# EAGLE design i2c-4x8matrix-relays (EAGLE 7.5.0)
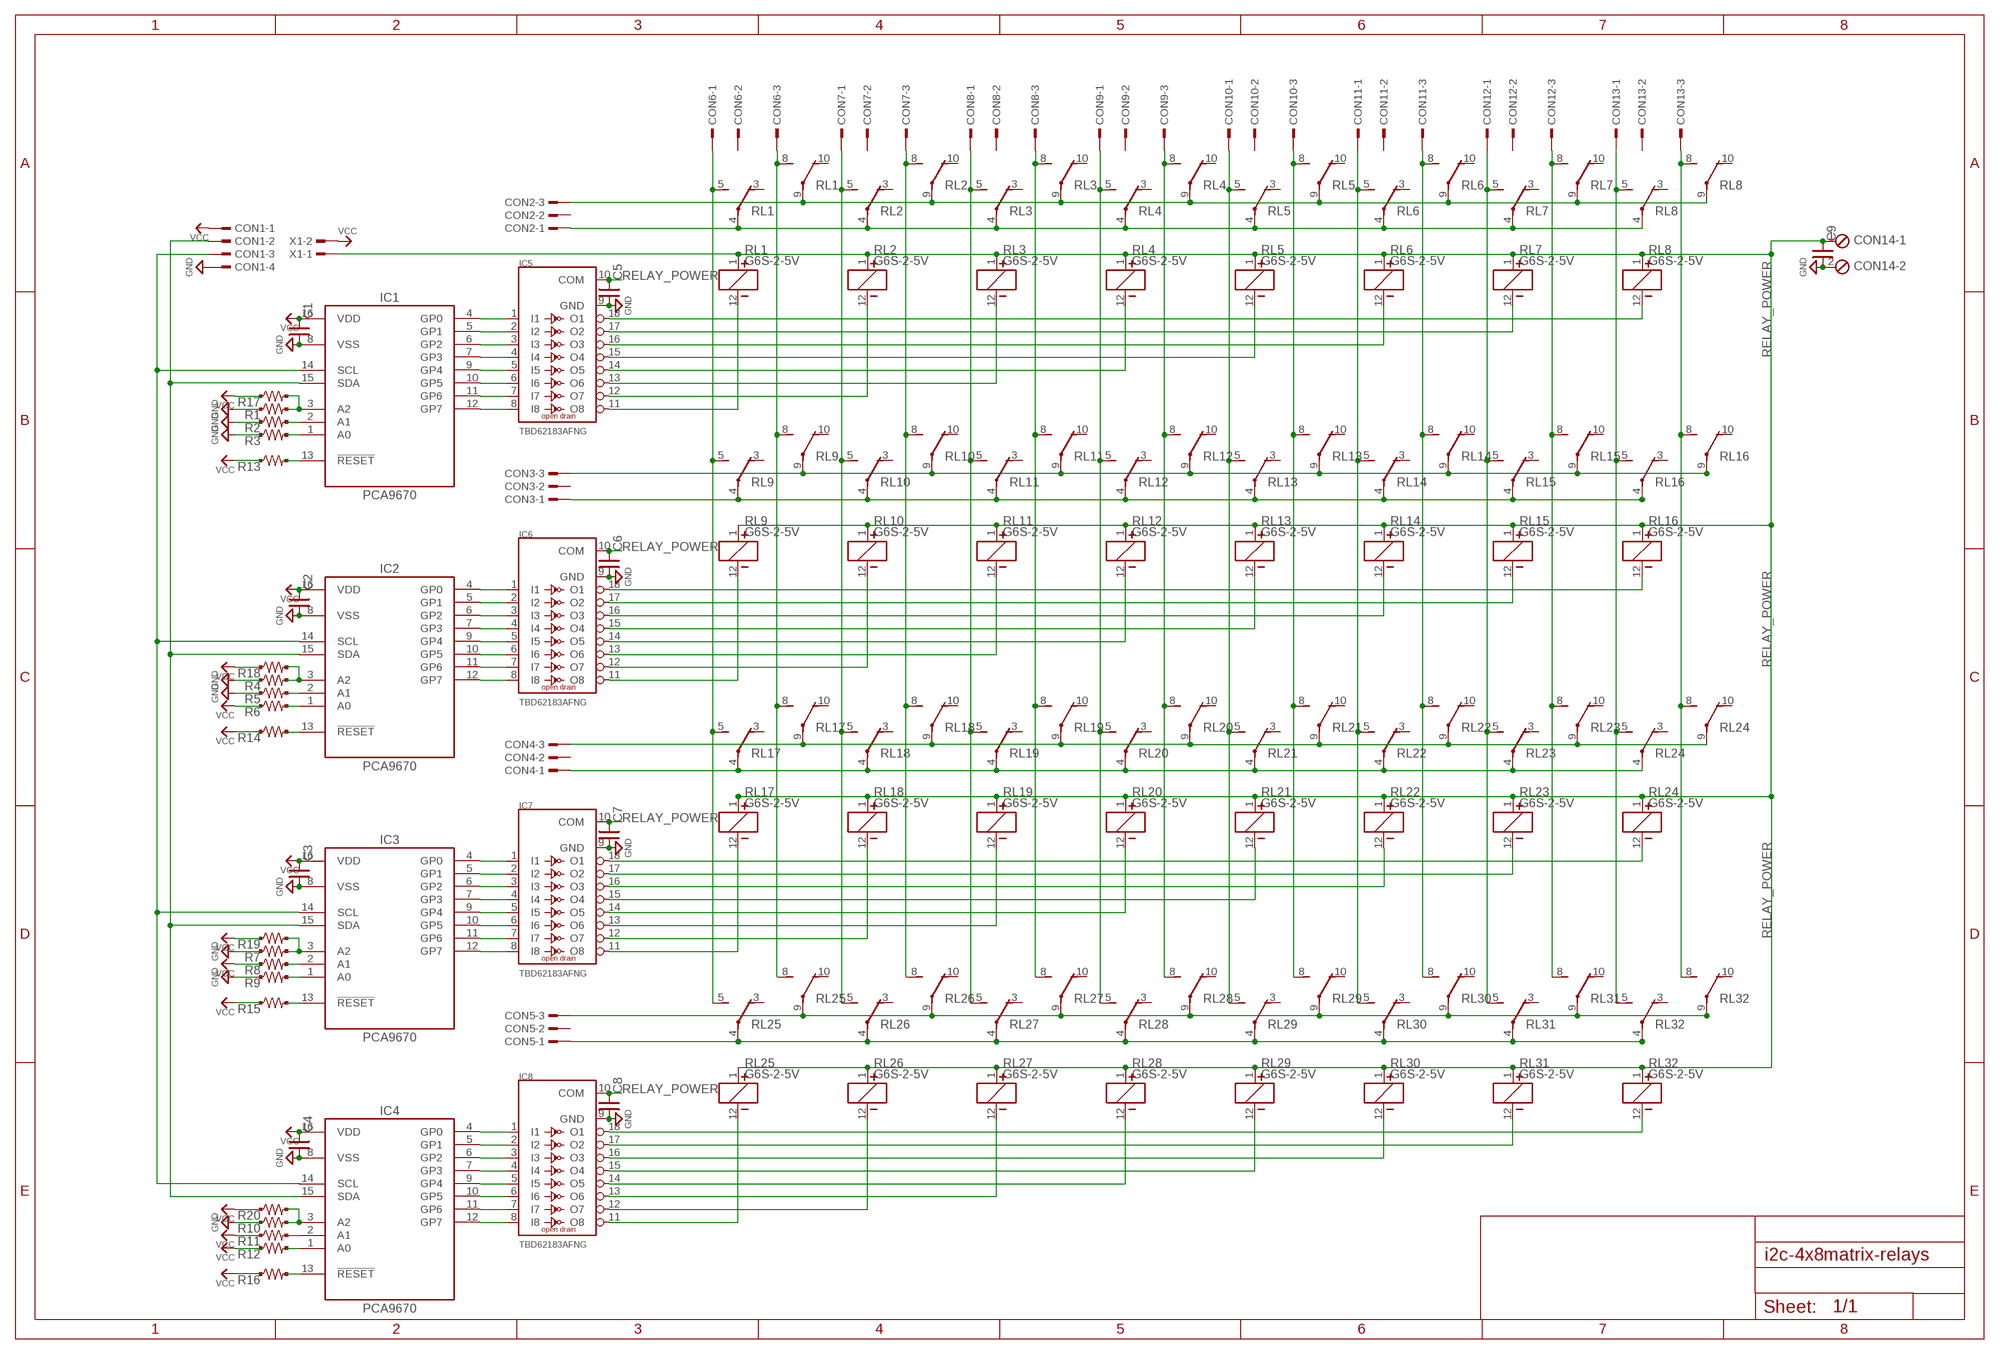
[diagram p0: schematic, sheet 1]

## Parts
C1  C-SMD-0.1U-1005  [C0402]
C2  C-SMD-0.1U-1005  [C0402]
C3  C-SMD-0.1U-1005  [C0402]
C4  C-SMD-0.1U-1005  [C0402]
C5  C-SMD-0.1U-1005  [C0402]
C6  C-SMD-0.1U-1005  [C0402]
C7  C-SMD-0.1U-1005  [C0402]
C8  C-SMD-0.1U-1005  [C0402]
C9  C-SMD-10U-1608  [CR-1608]
CON1  S4B-XH-A  [S4B-XH-A(LF)(SN)]
CON2  S3B-XH-A  [S3B-XH-A(LF)(SN)]
CON3  S3B-XH-A  [S3B-XH-A(LF)(SN)]
CON4  S3B-XH-A  [S3B-XH-A(LF)(SN)]
CON5  S3B-XH-A  [S3B-XH-A(LF)(SN)]
CON6  S3B-XH-A  [S3B-XH-A(LF)(SN)]
CON7  S3B-XH-A  [S3B-XH-A(LF)(SN)]
CON8  S3B-XH-A  [S3B-XH-A(LF)(SN)]
CON9  S3B-XH-A  [S3B-XH-A(LF)(SN)]
CON10  S3B-XH-A  [S3B-XH-A(LF)(SN)]
CON11  S3B-XH-A  [S3B-XH-A(LF)(SN)]
CON12  S3B-XH-A  [S3B-XH-A(LF)(SN)]
CON13  S3B-XH-A  [S3B-XH-A(LF)(SN)]
CON14  ETB43024B  [ETB43024]
IC1  PCA9670  [SOT65P510X450X110-16N]
IC2  PCA9670  [SOT65P510X450X110-16N]
IC3  PCA9670  [SOT65P510X450X110-16N]
IC4  PCA9670  [SOT65P510X450X110-16N]
IC5  TBD62183AFNG  [SOT65P640X440-18N]
IC6  TBD62183AFNG  [SOT65P640X440-18N]
IC7  TBD62183AFNG  [SOT65P640X440-18N]
IC8  TBD62183AFNG  [SOT65P640X440-18N]
R1  R-US--1005SHORT  [R0402SHORT]
R2  R-US--1005SHORT  [R0402SHORT]
R3  R-US--1005SHORT  [R0402SHORT]
R4  R-US--1005SHORT  [R0402SHORT]
R5  R-US--1005SHORT  [R0402SHORT]
R6  R-US--1005SHORT  [R0402SHORT]
R7  R-US--1005SHORT  [R0402SHORT]
R8  R-US--1005SHORT  [R0402SHORT]
R9  R-US--1005SHORT  [R0402SHORT]
R10  R-US--1005SHORT  [R0402SHORT]
R11  R-US--1005SHORT  [R0402SHORT]
R12  R-US--1005SHORT  [R0402SHORT]
R13  R-US--1005SHORT  [R0402SHORT]
R14  R-US--1005SHORT  [R0402SHORT]
R15  R-US--1005SHORT  [R0402SHORT]
R16  R-US--1005SHORT  [R0402SHORT]
R17  R-US-10K-1005  [C0402]
R18  R-US-10K-1005  [C0402]
R19  R-US-10K-1005  [C0402]
R20  R-US-10K-1005  [C0402]
RL1  G6S-2-5V  [G6S-2]
RL2  G6S-2-5V  [G6S-2]
RL3  G6S-2-5V  [G6S-2]
RL4  G6S-2-5V  [G6S-2]
RL5  G6S-2-5V  [G6S-2]
RL6  G6S-2-5V  [G6S-2]
RL7  G6S-2-5V  [G6S-2]
RL8  G6S-2-5V  [G6S-2]
RL9  G6S-2-5V  [G6S-2]
RL10  G6S-2-5V  [G6S-2]
RL11  G6S-2-5V  [G6S-2]
RL12  G6S-2-5V  [G6S-2]
RL13  G6S-2-5V  [G6S-2]
RL14  G6S-2-5V  [G6S-2]
RL15  G6S-2-5V  [G6S-2]
RL16  G6S-2-5V  [G6S-2]
RL17  G6S-2-5V  [G6S-2]
RL18  G6S-2-5V  [G6S-2]
RL19  G6S-2-5V  [G6S-2]
RL20  G6S-2-5V  [G6S-2]
RL21  G6S-2-5V  [G6S-2]
RL22  G6S-2-5V  [G6S-2]
RL23  G6S-2-5V  [G6S-2]
RL24  G6S-2-5V  [G6S-2]
RL25  G6S-2-5V  [G6S-2]
RL26  G6S-2-5V  [G6S-2]
RL27  G6S-2-5V  [G6S-2]
RL28  G6S-2-5V  [G6S-2]
RL29  G6S-2-5V  [G6S-2]
RL30  G6S-2-5V  [G6S-2]
RL31  G6S-2-5V  [G6S-2]
RL32  G6S-2-5V  [G6S-2]
X1  PH-1X2SG  [PH-1X2SG]

## Nets
GND: C1.2 C2.2 C3.2 C4.2 C5.2 C6.2 C7.2 C8.2 C9.2 CON1.4 CON14.2 IC1.8(VSS) IC2.8(VSS) IC3.8(VSS) IC4.8(VSS) IC5.9(GND) IC6.9(GND) IC7.9(GND) IC8.9(GND) R1.1 R1.2 R2.1 R2.2 R3.1 R3.2 R4.1 R4.2 R5.1 R5.2 R7.1 R7.2 R9.1 R9.2 R10.1 R10.2
N$1: CON3.1 RL9.4(COM) RL10.4(COM) RL11.4(COM) RL12.4(COM) RL13.4(COM) RL14.4(COM) RL15.4(COM) RL16.4(COM)
N$2: CON4.1 RL17.4(COM) RL18.4(COM) RL19.4(COM) RL20.4(COM) RL21.4(COM) RL22.4(COM) RL23.4(COM) RL24.4(COM)
N$3: CON2.1 RL1.4(COM) RL2.4(COM) RL3.4(COM) RL4.4(COM) RL5.4(COM) RL6.4(COM) RL7.4(COM) RL8.4(COM)
N$4: CON2.3 RL1.9(COM) RL2.9(COM) RL3.9(COM) RL4.9(COM) RL5.9(COM) RL6.9(COM) RL7.9(COM) RL8.9(COM)
N$6: CON6.1 RL1.5(NO) RL9.5(NO) RL17.5(NO) RL25.5(NO)
N$8: CON7.1 RL2.5(NO) RL10.5(NO) RL18.5(NO) RL26.5(NO)
N$9: CON3.3 RL9.9(COM) RL10.9(COM) RL11.9(COM) RL12.9(COM) RL13.9(COM) RL14.9(COM) RL15.9(COM) RL16.9(COM)
N$10: CON4.3 RL17.9(COM) RL18.9(COM) RL19.9(COM) RL20.9(COM) RL21.9(COM) RL22.9(COM) RL23.9(COM) RL24.9(COM)
N$11: IC8.18(O1) RL32.12
N$12: IC8.11(O8) RL25.12
N$13: CON8.1 RL3.5(NO) RL11.5(NO) RL19.5(NO) RL27.5(NO)
N$14: CON9.1 RL4.5(NO) RL12.5(NO) RL20.5(NO) RL28.5(NO)
N$15: IC1.4(GP0) IC5.1(I1)
N$16: IC1.5(GP1) IC5.2(I2)
N$26: IC1.6(GP2) IC5.3(I3)
N$36: CON6.3 RL1.8(NO) RL9.8(NO) RL17.8(NO) RL25.8(NO)
N$37: IC1.7(GP3) IC5.4(I4)
N$38: IC1.9(GP4) IC5.5(I5)
N$39: IC7.11(O8) RL17.12
N$40: CON7.3 RL2.8(NO) RL10.8(NO) RL18.8(NO) RL26.8(NO)
N$41: CON9.3 RL4.8(NO) RL12.8(NO) RL20.8(NO) RL28.8(NO)
N$42: CON8.3 RL3.8(NO) RL11.8(NO) RL19.8(NO) RL27.8(NO)
N$43: CON5.1 RL25.4(COM) RL26.4(COM) RL27.4(COM) RL28.4(COM) RL29.4(COM) RL30.4(COM) RL31.4(COM) RL32.4(COM)
N$44: CON5.3 RL25.9(COM) RL26.9(COM) RL27.9(COM) RL28.9(COM) RL29.9(COM) RL30.9(COM) RL31.9(COM) RL32.9(COM)
N$45: CON10.1 RL5.5(NO) RL13.5(NO) RL21.5(NO) RL29.5(NO)
N$46: CON10.3 RL5.8(NO) RL13.8(NO) RL21.8(NO) RL29.8(NO)
N$47: CON11.1 RL6.5(NO) RL14.5(NO) RL22.5(NO) RL30.5(NO)
N$48: CON11.3 RL6.8(NO) RL14.8(NO) RL22.8(NO) RL30.8(NO)
N$49: CON12.1 RL7.5(NO) RL15.5(NO) RL23.5(NO) RL31.5(NO)
N$50: CON12.3 RL7.8(NO) RL15.8(NO) RL23.8(NO) RL31.8(NO)
N$51: CON13.1 RL8.5(NO) RL16.5(NO) RL24.5(NO) RL32.5(NO)
N$52: CON13.3 RL8.8(NO) RL16.8(NO) RL24.8(NO) RL32.8(NO)
N$53: IC1.10(GP5) IC5.6(I6)
N$54: IC7.15(O4) RL21.12
N$55: IC7.18(O1) RL24.12
N$56: IC7.14(O5) RL20.12
N$57: IC7.12(O7) RL18.12
N$58: IC7.13(O6) RL19.12
N$59: IC7.16(O3) RL22.12
N$60: IC7.17(O2) RL23.12
N$61: IC1.11(GP6) IC5.7(I7)
N$62: IC1.12(GP7) IC5.8(I8)
N$63: IC2.4(GP0) IC6.1(I1)
N$64: IC2.5(GP1) IC6.2(I2)
N$65: IC2.6(GP2) IC6.3(I3)
N$66: IC2.7(GP3) IC6.4(I4)
N$67: IC2.9(GP4) IC6.5(I5)
N$68: IC2.10(GP5) IC6.6(I6)
N$69: IC2.11(GP6) IC6.7(I7)
N$70: IC2.12(GP7) IC6.8(I8)
N$71: IC3.4(GP0) IC7.1(I1)
N$72: IC3.5(GP1) IC7.2(I2)
N$73: IC3.6(GP2) IC7.3(I3)
N$74: IC3.7(GP3) IC7.4(I4)
N$75: IC3.9(GP4) IC7.5(I5)
N$76: IC3.10(GP5) IC7.6(I6)
N$77: IC3.11(GP6) IC7.7(I7)
N$78: IC3.12(GP7) IC7.8(I8)
N$79: IC4.4(GP0) IC8.1(I1)
N$80: IC4.5(GP1) IC8.2(I2)
N$81: IC4.6(GP2) IC8.3(I3)
N$82: IC4.7(GP3) IC8.4(I4)
N$83: IC4.9(GP4) IC8.5(I5)
N$84: IC4.10(GP5) IC8.6(I6)
N$85: IC4.11(GP6) IC8.7(I7)
N$86: IC4.12(GP7) IC8.8(I8)
N$87: IC8.17(O2) RL31.12
N$88: IC8.12(O7) RL26.12
N$89: CON1.3 IC1.14(SCL) IC2.14(SCL) IC3.14(SCL) IC4.14(SCL)
N$90: CON1.2 IC1.15(SDA) IC2.15(SDA) IC3.15(SDA) IC4.15(SDA)
N$91: IC8.13(O6) RL27.12
N$92: IC8.14(O5) RL28.12
N$93: IC8.15(O4) RL29.12
N$94: IC8.16(O3) RL30.12
N$95: IC4.1(A0) R12.3
N$96: IC4.2(A1) R11.3
N$97: IC4.3(A2) R10.3 R20.2
N$98: IC3.1(A0) R9.3
N$99: IC3.2(A1) R8.3
N$100: IC3.3(A2) R7.3 R19.2
N$101: IC2.1(A0) R6.3
N$102: IC2.2(A1) R5.3
N$103: IC2.3(A2) R4.3 R18.2
N$104: IC1.1(A0) R3.3
N$105: IC1.2(A1) R2.3
N$106: IC1.3(A2) R1.3 R17.2
N$107: IC1.13(!RESET!) R13.3
N$108: IC2.13(!RESET!) R14.3
N$109: IC3.13(!RESET!) R15.3
N$110: IC4.13(!RESET!) R16.3
N$112: IC6.11(O8) RL9.12
N$113: IC6.12(O7) RL10.12
N$114: IC6.13(O6) RL11.12
N$115: IC6.14(O5) RL12.12
N$116: IC6.15(O4) RL13.12
N$117: IC6.16(O3) RL14.12
N$118: IC6.17(O2) RL15.12
N$119: IC6.18(O1) RL16.12
N$120: IC5.11(O8) RL1.12
N$121: IC5.12(O7) RL2.12
N$122: IC5.13(O6) RL3.12
N$123: IC5.14(O5) RL4.12
N$124: IC5.15(O4) RL5.12
N$125: IC5.16(O3) RL6.12
N$126: IC5.17(O2) RL7.12
N$127: IC5.18(O1) RL8.12
RELAY_POWER: C5.1 C6.1 C7.1 C8.1 C9.1 CON14.1 IC5.10(COM) IC6.10(COM) IC7.10(COM) IC8.10(COM) RL1.1 RL2.1 RL3.1 RL4.1 RL5.1 RL6.1 RL7.1 RL8.1 RL9.1 RL10.1 RL11.1 RL12.1 RL13.1 RL14.1 RL15.1 RL16.1 RL17.1 RL18.1 RL19.1 RL20.1 RL21.1 RL22.1 RL23.1 RL24.1 RL25.1 RL26.1 RL27.1 RL28.1 RL29.1 RL30.1 RL31.1 RL32.1 X1.1
VCC: C1.1 C2.1 C3.1 C4.1 CON1.1 IC1.16(VDD) IC2.16(VDD) IC3.16(VDD) IC4.16(VDD) R6.1 R6.2 R8.1 R8.2 R11.1 R11.2 R12.1 R12.2 R13.1 R13.2 R14.1 R14.2 R15.1 R15.2 R16.1 R16.2 R17.1 R18.1 R19.1 R20.1 X1.2
Unconnected: CON2.2 CON3.2 CON4.2 CON5.2 CON6.2 CON7.2 CON8.2 CON9.2 CON10.2 CON11.2 CON12.2 CON13.2 RL1.3(NC) RL1.10(NC) RL2.3(NC) RL2.10(NC) RL3.3(NC) RL3.10(NC) RL4.3(NC) RL4.10(NC) RL5.3(NC) RL5.10(NC) RL6.3(NC) RL6.10(NC) RL7.3(NC) RL7.10(NC) RL8.3(NC) RL8.10(NC) RL9.3(NC) RL9.10(NC) RL10.3(NC) RL10.10(NC) RL11.3(NC) RL11.10(NC) RL12.3(NC) RL12.10(NC) RL13.3(NC) RL13.10(NC) RL14.3(NC) RL14.10(NC) RL15.3(NC) RL15.10(NC) RL16.3(NC) RL16.10(NC) RL17.3(NC) RL17.10(NC) RL18.3(NC) RL18.10(NC) RL19.3(NC) RL19.10(NC) RL20.3(NC) RL20.10(NC) RL21.3(NC) RL21.10(NC) RL22.3(NC) RL22.10(NC) RL23.3(NC) RL23.10(NC) RL24.3(NC) RL24.10(NC) RL25.3(NC) RL25.10(NC) RL26.3(NC) RL26.10(NC) RL27.3(NC) RL27.10(NC) RL28.3(NC) RL28.10(NC) RL29.3(NC) RL29.10(NC) RL30.3(NC) RL30.10(NC) RL31.3(NC) RL31.10(NC) RL32.3(NC) RL32.10(NC)

## Library data of the parts
C1-C8 = mylib:C-SMD-*: SMD CAPACITOR; DIGIKEY: 490-3261-1-ND; SEEED: 302010024; SMD-PAD: 2
C9 = mylib:C-SMD-*: SMD CAPACITOR; DIGIKEY: 445-11238-1-ND; SMD-PAD: 2
CON1 = mylib:S4B-XH-A; DIGIKEY: 455-2243-ND
CON2-CON13 = mylib:S3B-XH-A; DIGIKEY: 455-2250-ND
CON14 = mylib:ETB43024*; AKIZUKI: P-11589; DIGIKEY: 277-6765-ND
IC1-IC4 = mylib:PCA9670
IC5-IC8 = mylib:TBD62183A; DIGIKEY: TBD62183AFNGELCT-ND; MOUSER: 757-TBD62183AFNGEL
R1-R16 = mylib:R-US-*: SMD resistor Packages : -1608 : 1.6 x 0.8 mm -2125 : 2.0 x 1.25 mm -3216 : 3.2 x 1.6 mm; NOT-COMPONENT: YES
R17-R20 = mylib:R-US-*: SMD resistor Packages : -1608 : 1.6 x 0.8 mm -2125 : 2.0 x 1.25 mm -3216 : 3.2 x 1.6 mm; DIGIKEY: P10.0KLCT-ND; SEEED: 301010047; SMD-PAD: 2
RL1-RL32 = mylib:G6S-2-*; DIGIKEY: Z2615-ND
X1 = mylib:PH-1X2SG; AKIZUKI: C-08593; SEEED: 320020016; TH-PAD: 2

## Board
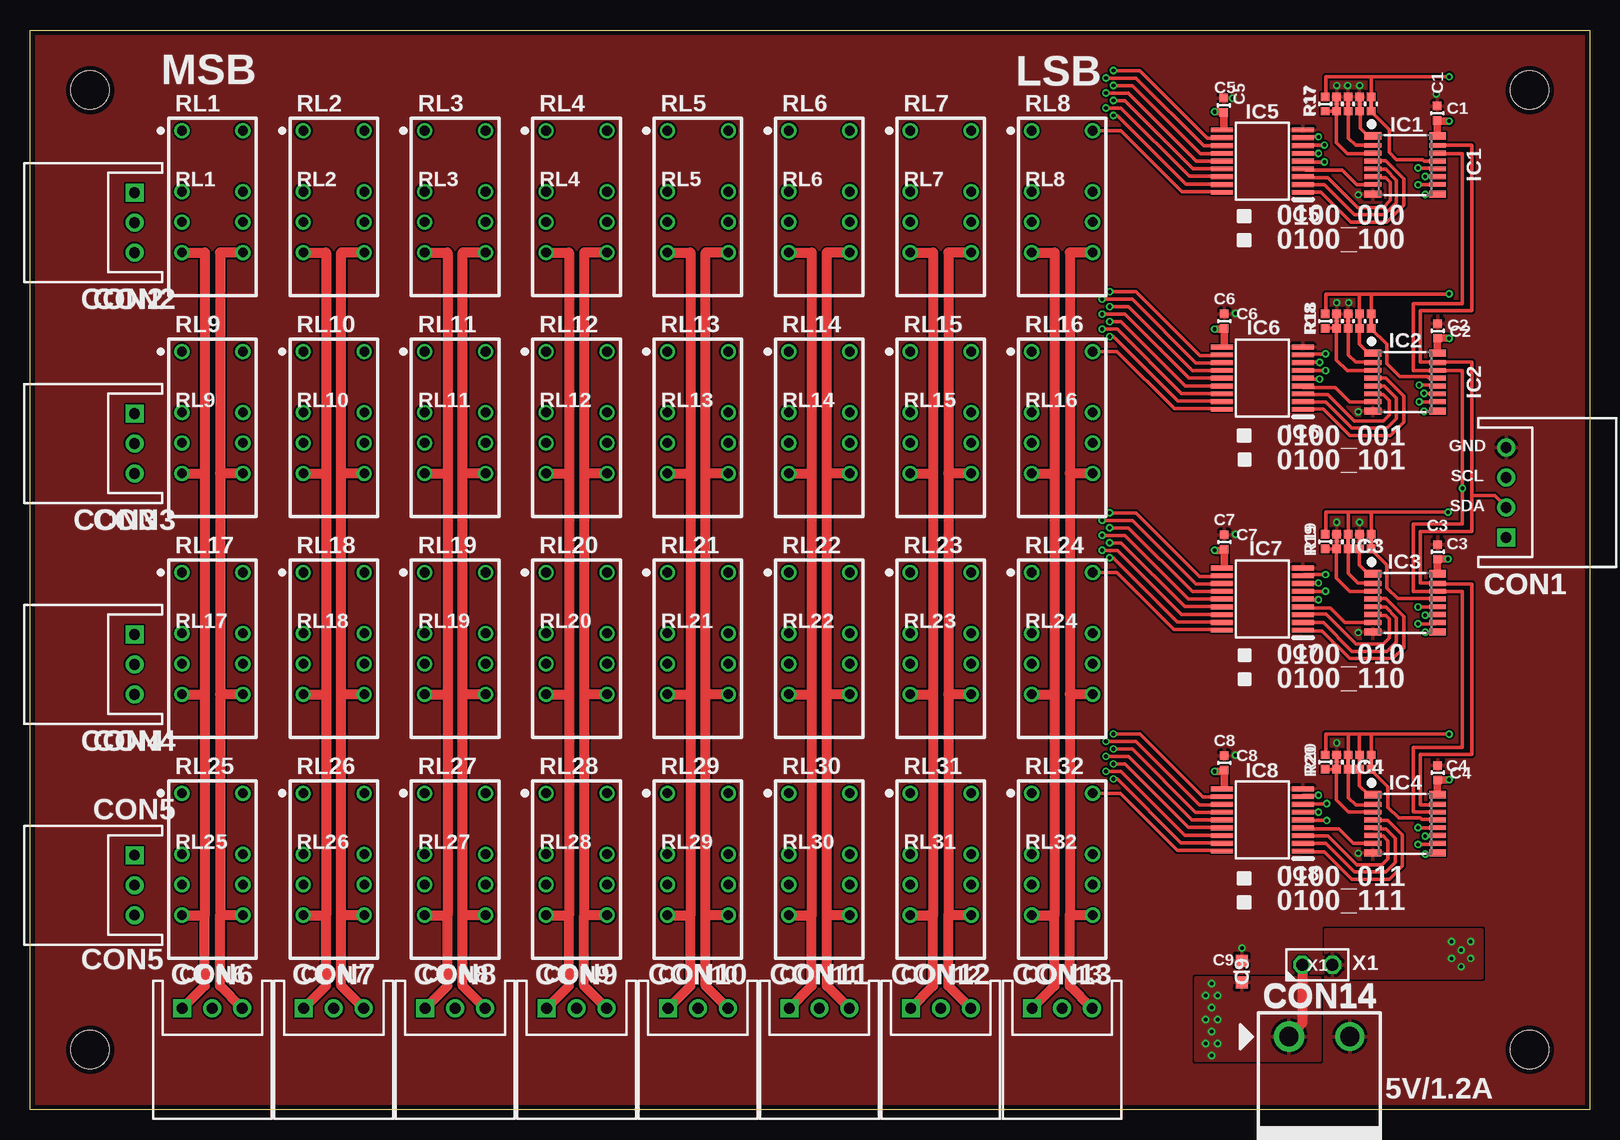
[diagram p1: board, top side]
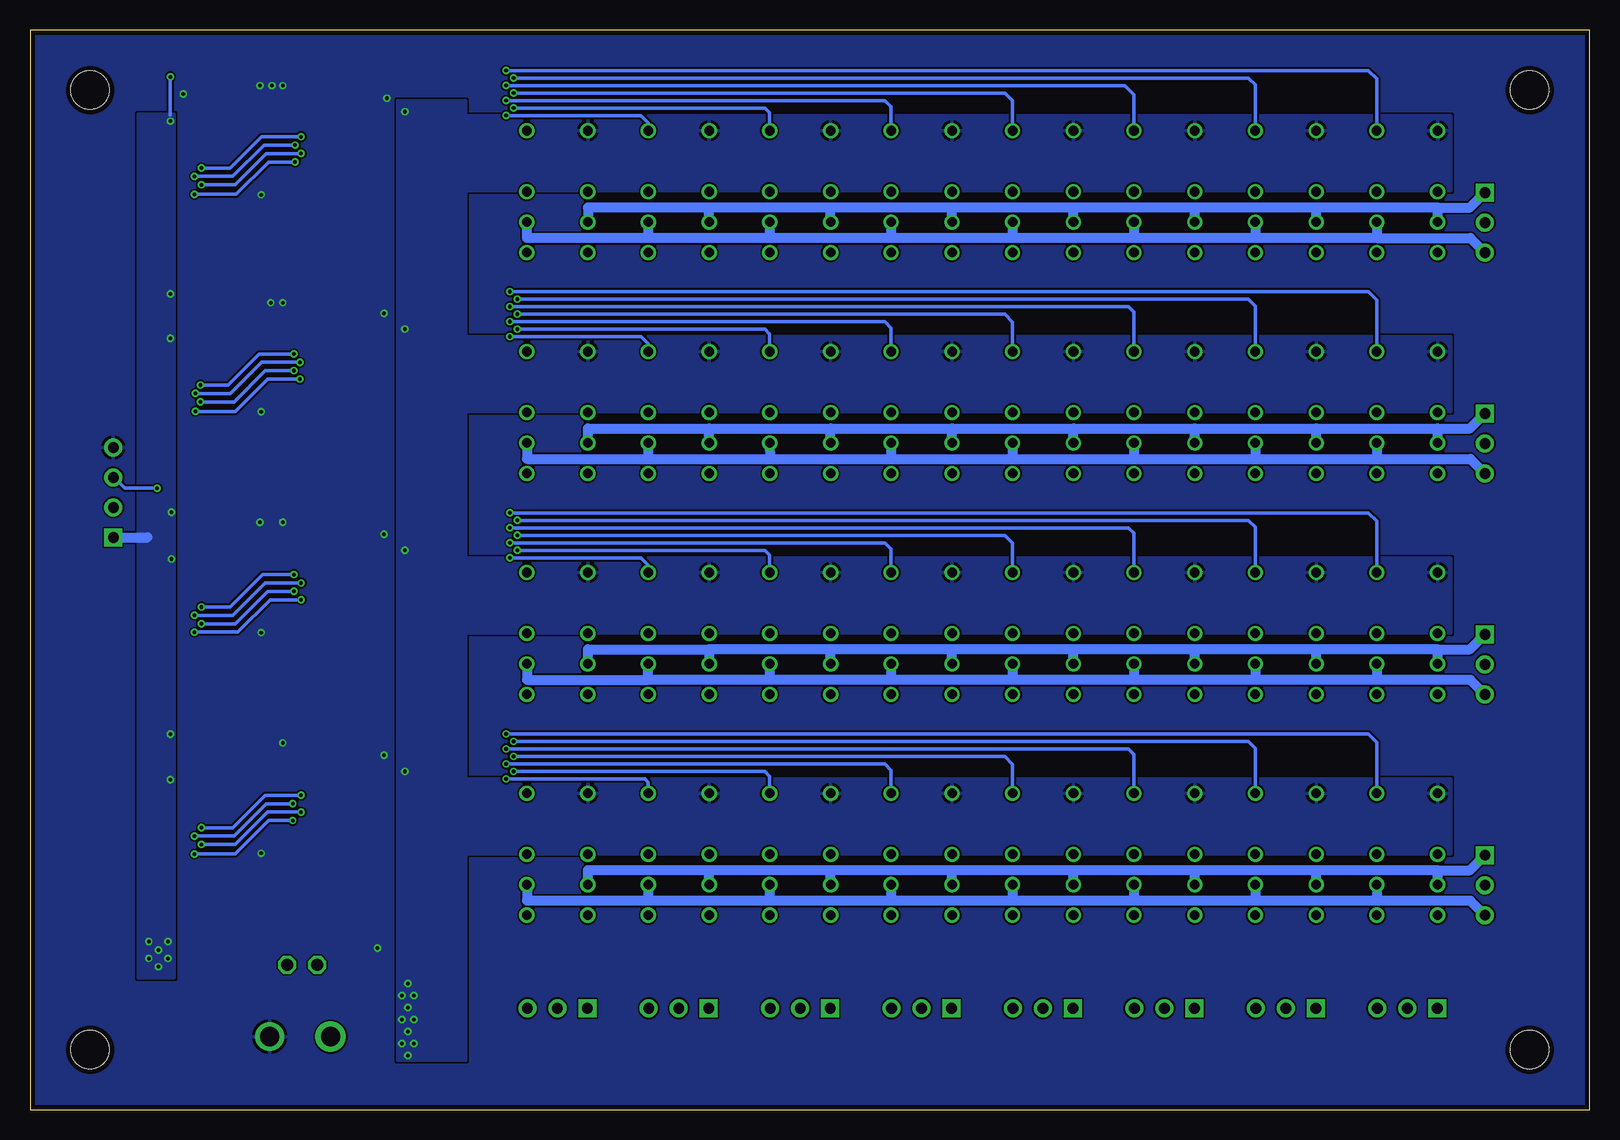
[diagram p2: board, bottom side, seen from below]

Size 130 x 90 mm. Coordinates in mm from the lower left corner, seen from the top.
Outline: 0,90 130,90 130,0 0,0 0,90
Copper layers (1*16): Top 0.035mm / dielectric 1.5mm / Bottom 0.035mm
Design rules "default": minimum track width 0.15mm, minimum drill 0.3mm, track to track 0.15mm, track to pad 0.15mm, pad to pad 0.15mm, via to via 0.15mm, smd to smd 0mil, copper to edge 0.4mm, drill to drill 8mil, minimum pad ring 0.15mm, minimum via ring 0.15mm, stop-mask expansion 4mil, vias tented up to drill 100mil, thermal gap 10mil
Holes 3.2 mm at 5,5 5,85 125,85 125,5

### Footprints (pad centres in the part's own frame; a part is rotated, then mirrored left to right if it is on the bottom)
C0402 = smd 0.7 x 0.7: 1 -0.6,0; 2 0.6,0
CR-1608 = smd 1 x 1: 1 -0.9,0; 2 0.9,0
S4B-XH-A(LF)(SN) = drill 0.9 pad 1.5 square: 1 -3.75,0 | drill 0.9 pad 1.5: 2 -1.25,0; 3 1.25,0; 4 3.75,0
S3B-XH-A(LF)(SN) = drill 0.9 pad 1.5 square: 1 -2.5,0 | drill 0.9 pad 1.5: 2 0,0; 3 2.5,0
ETB43024 = drill 1.6 pad 2.54: 1 -2.54,0 | drill 1.6: 2 2.54,0
SOT65P510X450X110-16N = smd 0.6 x 1.4: 1 -2.425,-2.7; 8 2.425,-2.7; 9 2.425,2.7; 16 -2.425,2.7 | smd 0.4 x 1.4: 2 -1.625,-2.7; 3 -0.975,-2.7; 4 -0.325,-2.7; 5 0.325,-2.7; 6 0.975,-2.7; 7 1.625,-2.7; 10 1.625,2.7; 11 0.975,2.7; 12 0.325,2.7; 13 -0.325,2.7; 14 -0.975,2.7; 15 -1.625,2.7
SOT65P640X440-18N = smd 0.4 x 1.8: 1 -2.6,-3.375; 2 -1.95,-3.375; 3 -1.3,-3.375; 4 -0.65,-3.375; 5 0,-3.375; 6 0.65,-3.375; 7 1.3,-3.375; 8 1.95,-3.375; 9 2.6,-3.375; 10 2.6,3.375; 11 1.95,3.375; 12 1.3,3.375; 13 0.65,3.375; 14 0,3.375; 15 -0.65,3.375; 16 -1.3,3.375; 17 -1.95,3.375; 18 -2.6,3.375
R0402SHORT = smd 0.7 x 0.7: 1 -0.6,0; 3 0.6,0 | smd 0.8 x 0.3: 2 0,0
G6S-2 = drill 0.8 pad 1.27: 1 -6.35,-2.54; 3 -1.27,-2.54; 4 1.27,-2.54; 5 3.81,-2.54; 8 3.81,2.54; 9 1.27,2.54; 10 -1.27,2.54; 12 -6.35,2.54
PH-1X2SG = drill 1 pad 1.5 octagon: 1 1.27,0; 2 -1.27,0

### Placement (x,y rotation side)
C1  117.3,83.06 90 top
C2  117.34,64.91 90 top
C3  117.34,46.5 90 top
C4  117.34,28.08 90 top
C5  99.5,83.72 90 top
C6  99.55,65.73 90 top
C7  99.55,47.31 90 top
C8  99.55,28.9 90 top
C9  101,11.5 90 top
CON1  123.05,51.44 90 top
CON2  8.71,73.94 270 top
CON3  8.71,55.53 270 top
CON4  8.71,37.12 270 top
CON5  8.71,18.7 270 top
CON6  15.2,8.44 0 top
CON7  25.32,8.44 0 top
CON8  35.44,8.44 0 top
CON9  45.56,8.44 0 top
CON10  55.68,8.44 0 top
CON11  65.8,8.44 0 top
CON12  75.92,8.44 0 top
CON13  86.04,8.44 0 top
CON14  107.49,6.08 0 top
IC1  114.63,78.75 270 top
IC2  114.63,60.65 270 top
IC3  114.63,42.23 270 top
IC4  114.63,23.82 270 top
IC5  102.73,79.06 90 top
IC6  102.73,60.97 90 top
IC7  102.73,42.55 90 top
IC8  102.73,24.14 90 top
R1  108.92,83.83 270 top
R2  109.87,83.83 270 top
R3  110.83,83.83 270 top
R4  108.92,65.73 270 top
R5  109.87,65.73 270 top
R6  110.83,65.73 270 top
R7  108.92,47.34 270 top
R8  109.87,47.34 270 top
R9  110.83,47.34 270 top
R10  108.92,28.96 270 top
R11  109.87,28.96 270 top
R12  110.83,28.96 270 top
R13  111.78,83.83 270 top
R14  111.78,65.73 270 top
R15  111.78,47.34 270 top
R16  111.78,28.96 270 top
R17  107.97,83.83 270 top
R18  107.97,65.73 270 top
R19  107.97,47.34 270 top
R20  107.97,28.96 270 top
RL1  15.2,75.25 270 top
RL2  25.32,75.25 270 top
RL3  35.44,75.25 270 top
RL4  45.56,75.25 270 top
RL5  55.68,75.25 270 top
RL6  65.8,75.25 270 top
RL7  75.92,75.25 270 top
RL8  86.04,75.25 270 top
RL9  15.2,56.84 270 top
RL10  25.32,56.84 270 top
RL11  35.44,56.84 270 top
RL12  45.56,56.84 270 top
RL13  55.68,56.84 270 top
RL14  65.8,56.84 270 top
RL15  75.92,56.84 270 top
RL16  86.04,56.84 270 top
RL17  15.2,38.42 270 top
RL18  25.32,38.42 270 top
RL19  35.44,38.42 270 top
RL20  45.56,38.42 270 top
RL21  55.68,38.42 270 top
RL22  65.8,38.42 270 top
RL23  75.92,38.42 270 top
RL24  86.04,38.42 270 top
RL25  15.2,20.01 270 top
RL26  25.32,20.01 270 top
RL27  35.44,20.01 270 top
RL28  45.56,20.01 270 top
RL29  55.68,20.01 270 top
RL30  65.8,20.01 270 top
RL31  75.92,20.01 270 top
RL32  86.04,20.01 270 top
X1  107.31,12.06 180 top

### Tracks (layer width: path | path; a pad name or v marks a point on that pad's centre or on a via)
GND  (via drill 0.3)
  other vias: 100.24,84.31 100.49,47.96 100.49,29.55 100.49,66.38 101.03,13.46 110.73,21.36 110.73,39.76 110.73,58.16 110.73,76.26 117.23,84.66 108.93,85.36 109.83,85.36 110.83,85.36 108.93,67.26 109.93,67.26 108.93,48.96 110.83,48.96 108.93,30.56
  pour Bottom (rank 2): 0,90 130.65,90 130.65,0 0,0
  pour Top (rank 2): -0.32,90 130.33,90 130.33,0 -0.32,0
N$1
  Bottom 0.813: 73.38,56.78 83.5,56.78 RL16.4 83.5,55.51 | 73.38,56.78 63.26,56.78 | 63.26,56.78 53.14,56.78 | 53.14,56.78 43.02,56.78 | 43.02,56.78 32.9,56.78 | 32.9,56.78 22.78,56.78 | 22.78,56.78 12.66,56.78 | 43.02,56.78 RL12.4 43.02,55.51 | 32.9,56.78 RL11.4 32.9,55.51 | 22.78,56.78 RL10.4 22.78,55.51 | 53.14,56.78 RL13.4 53.14,55.51 | 63.26,56.78 RL14.4 63.26,55.51 | 73.38,55.51 RL15.4 73.38,56.78 | 12.66,55.51 RL9.4 12.66,56.78 | 12.66,56.78 9.96,56.78 CON3.1
N$2
  Bottom 0.813: 73.38,38.37 83.5,38.37 RL24.4 83.5,37.09 | 73.38,38.37 RL23.4 73.38,37.09 | 63.26,37.09 RL22.4 63.26,38.37 | 63.26,38.37 73.38,38.37 | 53.14,37.09 RL21.4 53.14,38.37 | 53.14,38.37 63.26,38.37 | 43.02,38.37 RL20.4 43.02,37.09 | 43.02,38.37 53.14,38.37 | 32.9,38.37 RL19.4 32.9,37.09 | 32.9,38.37 43.02,38.37 | 22.78,38.37 RL18.4 22.78,37.09 | 22.78,38.37 32.9,38.37 | 12.66,38.37 RL17.4 12.66,37.09 | 12.66,38.37 22.78,38.37 | 12.66,38.37 9.96,38.37 CON4.1
N$3
  Bottom 0.813: 12.66,75.19 RL1.4 12.66,73.92 | 12.66,75.19 22.78,75.19 | 22.78,75.19 32.9,75.19 | 32.9,75.19 43.02,75.19 | 43.02,75.19 53.14,75.19 | 53.14,75.19 63.26,75.19 | 63.26,75.19 73.38,75.19 | 73.38,75.19 83.5,75.19 RL8.4 83.5,73.92 | 73.38,73.92 RL7.4 73.38,75.19 | 63.26,75.19 RL6.4 63.26,73.92 | 53.14,73.92 RL5.4 53.14,75.19 | 43.02,73.92 RL4.4 43.02,75.19 | 32.9,75.19 RL3.4 32.9,73.92 | 22.78,75.19 RL2.4 22.78,73.92 | 12.66,75.19 9.96,75.19 CON2.1
N$4
  Bottom 0.813: RL1.9 17.74,72.66 | 17.74,72.66 27.86,72.66 | 27.86,72.66 37.98,72.66 | 37.98,72.66 48.1,72.66 | 48.1,72.66 58.22,72.66 | 58.22,72.66 68.34,72.66 | 68.34,72.66 78.46,72.66 | 78.46,72.66 88.58,72.66 RL8.9 | RL7.9 78.46,72.66 | RL5.9 58.22,72.66 | RL4.9 48.1,72.66 | RL3.9 37.98,72.66 | RL2.9 27.86,72.66 | RL6.9 68.34,72.66 | 17.74,72.66 9.93,72.66 CON2.3
N$6
  Top 0.813: 14.56,53.03 14.56,71.44 RL1.5 | 14.56,53.03 14.56,34.62 | 14.56,34.62 14.56,16.2 | RL25.5 14.56,16.2 | RL17.5 14.56,34.62 | RL9.5 14.56,53.03 | CON6.1 14.56,10.3 14.56,16.2
N$8
  Top 0.813: 24.68,53.03 24.68,71.44 RL2.5 | 24.68,53.03 24.68,34.62 | 24.68,34.62 24.68,16.2 | RL26.5 24.68,16.2 | RL18.5 24.68,34.62 | RL10.5 24.68,53.03 | CON7.1 24.68,10.3 24.68,16.2
N$9
  Bottom 0.813: RL16.9 88.58,54.24 78.46,54.24 | 78.46,54.24 68.3,54.24 | 68.3,54.24 58.22,54.24 | 58.22,54.24 48.1,54.24 | 48.1,54.24 37.98,54.24 | 37.98,54.24 27.86,54.24 | 27.86,54.24 17.74,54.24 | RL9.9 17.74,54.24 | RL10.9 27.86,54.24 | RL11.9 37.98,54.24 | RL12.9 48.1,54.24 | RL13.9 58.22,54.24 | 68.3,54.24 68.34,55.51 RL14.9 | RL15.9 78.46,54.24 | 17.74,54.24 9.93,54.24 CON3.3
N$10
  Bottom 0.813: RL24.9 88.58,35.83 78.46,35.83 | 78.46,35.83 RL23.9 | 58.22,35.83 68.34,35.83 | 68.34,35.83 78.46,35.83 | RL21.9 58.22,35.83 | RL20.9 48.1,35.83 | 48.1,35.83 58.22,35.83 | RL19.9 37.98,35.83 | 37.98,35.83 48.1,35.83 | RL18.9 27.86,35.83 | 27.86,35.83 37.98,35.83 | RL17.9 17.74,35.83 | 17.74,35.83 27.86,35.83 | 17.74,35.83 9.93,35.83 CON4.3 | RL22.9 68.34,35.83
N$11
  Top 0.305: IC8.18 98.98,21.54 98.92,21.6 95.65,21.6 90.89,26.36 RL32.12
N$12  (via drill 0.3)
  Top 0.305: IC8.11 99.28,26.09 99.23,26.04 97.77,26.04 92.5,31.31 v90.31,31.31
  Bottom 0.305: v90.31,31.31 18.44,31.31 17.74,30.61 RL25.12
N$13
  Top 0.813: 34.8,53.03 34.8,71.44 RL3.5 | 34.8,53.03 34.8,34.62 | 34.8,34.62 34.8,16.2 | RL11.5 34.8,53.03 | RL27.5 34.8,16.2 | RL19.5 34.8,34.62 | CON8.1 34.8,10.3 34.8,16.2
N$14
  Top 0.813: 44.92,53.03 44.92,71.44 RL4.5 | 44.92,53.03 44.92,34.62 | 44.92,34.62 44.92,16.2 | RL12.5 44.92,53.03 | RL28.5 44.92,16.2 | RL20.5 44.92,34.62 | CON9.1 44.92,10.3 44.92,16.2
N$15
  Top 0.305: IC1.4 111.97,79.07 112,79.1 113,79.1 114.5,77.6 114.5,75.4 113.1,74 110.1,74 107.6,76.5 106.2,76.5 106.17,76.47 IC5.1
N$16
  Top 0.305: IC1.5 111.98,78.42 112,78.4 113,78.4 113.9,77.5 113.9,75.6 112.9,74.6 110.4,74.6 107.9,77.1 IC5.2
N$26
  Top 0.305: IC1.6 112,77.7 113,77.7 113.4,77.3 113.4,75.8 112.8,75.2 110.7,75.2 108.2,77.7 106.1,77.7 IC5.3
N$36
  Top 0.813: 15.84,53.03 15.84,71.44 RL1.8 | 15.84,53.03 15.84,34.62 | 15.84,34.62 15.84,16.2 | RL25.8 15.84,16.2 | RL17.8 15.84,34.62 | RL9.8 15.84,53.03 | CON6.3 15.84,10.3 15.84,16.2
N$37
  Top 0.305: IC1.7 111.9,77.1 110.6,77.1 109.4,78.3 106.3,78.3 106.19,78.42 IC5.4
N$38  (via drill 0.3)
  Top 0.305: IC1.9 117.3,76.3 v116.3,76.3 | IC5.5 106.1,79 v107.9,79
  Bottom 0.305: v116.3,76.3 112.8,76.3 110.1,79 v107.9,79
N$39  (via drill 0.3)
  Top 0.305: IC7.11 99.28,44.5 99.23,44.46 97.48,44.46 92.19,49.75 v90,49.75
  Bottom 0.305: v90,49.75 18.44,49.75 17.74,49.05 RL17.12
N$40
  Top 0.813: 25.95,16.2 25.95,34.62 | 25.95,34.62 25.95,53.03 | 25.95,53.03 25.95,71.44 RL2.8 | RL26.8 25.95,16.2 | RL18.8 25.95,34.62 | RL10.8 25.95,53.03 | CON7.3 25.95,10.3 25.95,16.2
N$41
  Top 0.813: 46.2,53.03 46.2,71.44 RL4.8 | 46.2,53.03 46.2,34.62 | 46.2,34.62 46.2,16.2 | RL12.8 46.2,53.03 | RL28.8 46.2,16.2 | RL20.8 46.2,34.62 | CON9.3 46.2,10.3 46.2,16.2
N$42
  Top 0.813: 36.08,16.2 36.08,34.62 | 36.08,34.62 36.08,53.03 | 36.08,53.03 36.08,71.44 RL3.8 | RL11.8 36.08,53.03 | RL27.8 36.08,16.2 | RL19.8 36.08,34.62 | CON8.3 36.08,10.3 36.08,16.2
N$43
  Bottom 0.813: 12.66,19.95 22.78,19.95 | 22.78,19.95 32.9,19.95 | 32.9,19.95 43.02,19.95 | 43.02,19.95 53.14,19.95 | 53.14,19.95 63.26,19.95 | 63.26,19.95 73.38,19.95 | 73.38,19.95 83.5,19.95 RL32.4 | RL31.4 73.38,19.95 | RL25.4 12.66,19.95 | RL26.4 22.78,19.95 | RL27.4 32.9,19.95 | RL28.4 43.02,19.95 | RL29.4 53.14,19.95 | RL30.4 63.26,19.95 | 12.66,19.95 9.96,19.95 CON5.1
N$44
  Bottom 0.813: 17.74,17.41 9.93,17.41 CON5.3 | 17.74,17.41 27.86,17.41 | 27.86,17.41 37.98,17.41 | 37.98,17.41 48.1,17.41 | 48.1,17.41 58.22,17.41 | 58.22,17.41 68.34,17.41 | 68.34,17.41 78.46,17.41 | 78.46,17.41 88.58,17.41 RL32.9 | RL25.9 17.74,17.41 | RL26.9 27.86,17.41 | RL27.9 37.98,17.41 | RL28.9 48.1,17.41 | RL29.9 58.22,17.41 | RL30.9 68.34,17.41 | RL31.9 78.46,17.41
N$45
  Top 0.813: 55.05,53.03 55.05,71.44 RL5.5 | 55.05,53.03 55.05,34.62 | 55.05,34.62 55.05,16.2 | RL13.5 55.05,53.03 | RL21.5 55.05,34.62 | RL29.5 55.05,16.2 | CON10.1 55.05,10.3 55.05,16.2
N$46
  Top 0.813: 56.31,16.2 56.31,34.62 | 56.31,34.62 56.31,53.03 | 56.31,53.03 56.31,71.44 RL5.8 | RL13.8 56.31,53.03 | RL21.8 56.31,34.62 | RL29.8 56.31,16.2 | CON10.3 56.31,10.3 56.31,16.2
N$47
  Top 0.813: 65.17,53.03 65.17,71.44 RL6.5 | 65.17,53.03 65.17,34.62 | 65.17,34.62 65.17,16.25 65.17,16.2 | RL14.5 65.17,53.03 | RL30.5 65.17,16.2 | RL22.5 65.17,34.62 | CON11.1 65.17,10.3 65.17,16.2
N$48
  Top 0.813: 66.44,16.2 66.44,34.62 | 66.44,34.62 66.44,53.03 | 66.44,53.03 66.44,71.44 RL6.8 | RL14.8 66.44,53.03 | RL30.8 66.44,16.2 | RL22.8 66.44,34.62 | CON11.3 66.44,10.3 66.44,16.2
N$49
  Top 0.813: 75.28,53.03 75.28,71.44 RL7.5 | 75.28,53.03 75.28,34.62 | 75.28,34.62 75.28,16.2 | RL15.5 75.28,53.03 | RL31.5 75.28,16.2 | RL23.5 75.28,34.62 | CON12.1 75.28,10.3 75.28,16.2
N$50
  Top 0.813: 76.56,53.03 76.56,71.44 RL7.8 | 76.56,53.03 76.56,34.62 | 76.56,34.62 76.56,16.2 | RL15.8 76.56,53.03 | RL31.8 76.56,16.2 | RL23.8 76.56,34.62 | CON12.3 76.56,10.3 76.56,16.2
N$51
  Top 0.813: 85.41,53.03 85.41,71.44 RL8.5 | 85.41,53.03 85.41,34.62 | 85.41,34.62 85.41,16.2 | RL32.5 85.41,16.2 | RL24.5 85.41,34.62 | RL16.5 85.41,53.03 | CON13.1 85.41,10.3 85.41,16.2
N$52
  Top 0.813: 86.67,53.03 86.67,71.44 RL8.8 | 86.67,53.03 86.67,34.62 | 86.67,34.62 86.67,16.2 | RL32.8 86.67,16.2 | RL24.8 86.67,34.62 | RL16.8 86.67,53.03 | CON13.3 86.67,10.3 86.67,16.2
N$53  (via drill 0.3)
  Top 0.305: IC1.10 117.3,77.1 v115.7,77.1 | IC5.6 106.1,79.7 v107.4,79.7
  Bottom 0.305: v107.4,79.7 110.3,79.7 112.9,77.1 v115.7,77.1
N$54  (via drill 0.3)
  Top 0.305: IC7.15 99.25,41.9 99.23,41.92 96.27,41.92 90.94,47.25 v90,47.25
  Bottom 0.305: v90,47.25 58.75,47.25 58.22,46.72 RL21.12
N$55
  Top 0.305: IC7.18 99.3,39.95 99.23,40.01 95.36,40.01 90.6,44.77 RL24.12
N$56  (via drill 0.3)
  Top 0.305: IC7.14 96.57,42.55 91.25,47.88 v89.38,47.88
  Bottom 0.305: v89.38,47.88 48.75,47.88 48.1,47.23 RL20.12
N$57  (via drill 0.3)
  Top 0.305: IC7.12 99.27,43.85 99.23,43.82 97.18,43.82 91.88,49.12 v89.38,49.12
  Bottom 0.305: v89.38,49.12 28.44,49.12 27.86,48.55 RL18.12
N$58  (via drill 0.3)
  Top 0.305: IC7.13 99.25,43.2 99.23,43.19 96.88,43.19 91.56,48.5 v90,48.5
  Bottom 0.305: v90,48.5 38.44,48.5 37.98,48.04 RL19.12
N$59  (via drill 0.3)
  Top 0.305: IC7.16 99.27,41.25 99.23,41.28 95.97,41.28 90.62,46.62 v89.38,46.62
  Bottom 0.305: v89.38,46.62 68.75,46.62 68.34,46.22 RL22.12
N$60  (via drill 0.3)
  Top 0.305: IC7.17 99.28,40.6 99.23,40.65 95.67,40.65 90.31,46 v90,46
  Bottom 0.305: RL23.12 78.46,45.4 79.06,46 v90,46
N$61  (via drill 0.3)
  Top 0.305: IC1.11 117.23,77.77 117.2,77.8 v116.3,77.8 | IC5.7 106.1,80.4 v107.9,80.4
  Bottom 0.305: v107.9,80.4 110.5,80.4 113.1,77.8 v116.3,77.8
N$62  (via drill 0.3)
  Top 0.305: IC5.8 106.1,81.1 v107.4,81.1 | v115.7,78.5 117.3,78.5 117.32,78.48 IC1.12
  Bottom 0.305: v107.4,81.1 110.7,81.1 113.3,78.5 v115.7,78.5
N$63
  Top 0.305: IC6.1 106.1,58.4 107.8,58.4 110,56.2 113.4,56.2 114.5,57.3 114.5,59.5 113,61 112,61 111.97,60.98 IC2.4
N$64
  Top 0.305: IC6.2 106.1,59 108,59 110.2,56.8 113.1,56.8 113.9,57.6 113.9,59.3 112.9,60.3 112,60.3 111.97,60.33 IC2.5
N$65
  Top 0.305: IC6.3 106.1,59.6 108.2,59.6 110.4,57.4 112.8,57.4 113.3,57.9 113.3,59.1 112.8,59.6 112,59.6 IC2.6
N$66
  Top 0.305: IC6.4 106.1,60.2 108.8,60.2 110,59 111.9,59 IC2.7
N$67  (via drill 0.3)
  Top 0.305: IC6.5 106.1,60.9 v107.5,60.9 | IC2.9 117.3,58.2 v116.2,58.2
  Bottom 0.305: v116.2,58.2 112.9,58.2 110.2,60.9 v107.5,60.9
N$68  (via drill 0.3)
  Top 0.305: IC6.6 106.1,61.6 v108,61.6 | IC2.10 117.3,59 v115.8,59
  Bottom 0.305: v115.8,59 113,59 110.4,61.6 v108,61.6
N$69  (via drill 0.3)
  Top 0.305: IC6.7 106.1,62.3 v107.5,62.3 | IC2.11 117.3,59.7 v116.2,59.7
  Bottom 0.305: v107.5,62.3 110.7,62.3 113.3,59.7 v116.2,59.7
N$70  (via drill 0.3)
  Top 0.305: IC6.8 106.1,63 v108,63 | IC2.12 117.33,60.37 117.3,60.4 v115.8,60.4
  Bottom 0.305: v115.8,60.4 113.5,60.4 110.9,63 v108,63
N$71
  Top 0.305: IC3.4 111.96,42.56 112,42.6 113,42.6 114.5,41.1 114.5,38.5 113.6,37.6 110,37.6 107.7,39.9 106.1,39.9 IC7.1
N$72
  Top 0.305: IC3.5 111.91,41.91 111.9,41.9 113,41.9 113.9,41 113.9,39 113.1,38.2 110.2,38.2 107.8,40.6 106.2,40.6 IC7.2
N$73
  Top 0.305: IC3.6 112,41.2 113,41.2 113.3,40.9 113.3,39.3 112.8,38.8 110.5,38.8 108,41.3 106.1,41.3 IC7.3
N$74
  Top 0.305: IC3.7 111.91,40.61 111.9,40.6 109.6,40.6 108.4,41.8 106.1,41.8 IC7.4
N$75  (via drill 0.3)
  Top 0.305: IC3.9 117.31,39.81 117.3,39.8 v116.3,39.8 | IC7.5 106.1,42.5 v107.4,42.5
  Bottom 0.305: v107.4,42.5 110,42.5 112.7,39.8 v116.3,39.8
N$76  (via drill 0.3)
  Top 0.305: IC3.10 117.31,40.61 117.2,40.5 v115.7,40.5 | IC7.6 v108,43.2
  Bottom 0.305: v108,43.2 110.2,43.2 112.9,40.5 v115.7,40.5
N$77  (via drill 0.3)
  Top 0.305: IC3.11 117.33,41.27 117.3,41.3 117.2,41.2 v116.3,41.2 | IC7.7 106.15,43.85 106.2,43.9 v107.4,43.9
  Bottom 0.305: v107.4,43.9 110.4,43.9 113.1,41.2 v116.3,41.2
N$78  (via drill 0.3)
  Top 0.305: IC3.12 117.31,41.91 117.3,41.9 v115.7,41.9 | IC7.8 106.2,44.6 v108,44.6
  Bottom 0.305: v108,44.6 110.6,44.6 113.3,41.9 v115.7,41.9
N$79
  Top 0.305: IC8.1 106.1,21.5 107.9,21.5 110.2,19.2 113.3,19.2 114.4,20.3 114.4,22.9 113.2,24.1 111.9,24.1 111.93,24.13 IC4.4
N$80
  Top 0.305: IC4.5 111.93,23.47 112,23.4 113,23.4 113.8,22.6 113.8,20.6 113,19.8 110.4,19.8 108,22.2 IC8.2
N$81
  Top 0.305: IC4.6 111.95,22.84 112,22.8 112.8,22.8 113.2,22.4 113.2,20.9 112.7,20.4 110.6,20.4 108.2,22.8 106.2,22.8 106.16,22.84 IC8.3
N$82
  Top 0.305: IC4.7 111.91,22.2 111.9,22.2 110.3,22.2 109.1,23.4 106.1,23.4 IC8.4
N$83  (via drill 0.3)
  Top 0.305: IC4.9 117.33,21.33 117.3,21.3 v116.3,21.3 | IC8.5 106.1,24.1 v108.1,24.1
  Bottom 0.305: v116.3,21.3 112.9,21.3 110.1,24.1 v108.1,24.1
N$84  (via drill 0.3)
  Top 0.305: IC8.6 v107.4,24.8 | IC4.10 117.33,22.13 117.3,22.1 v115.7,22.1
  Bottom 0.305: v107.4,24.8 110.2,24.8 112.9,22.1 v115.7,22.1
N$85  (via drill 0.3)
  Top 0.305: IC4.11 117.33,22.83 117.3,22.8 v116.3,22.8 | IC8.7 106.1,25.5 v108.1,25.5
  Bottom 0.305: v116.3,22.8 113,22.8 110.3,25.5 v108.1,25.5
N$86  (via drill 0.3)
  Top 0.305: IC4.12 117.31,23.5 117.3,23.5 v115.7,23.5 | IC8.8 106.1,26.2 v107.4,26.2
  Bottom 0.305: v115.7,23.5 113.1,23.5 110.4,26.2 v107.4,26.2
N$87  (via drill 0.3)
  Top 0.305: IC8.17 99.28,22.19 99.23,22.23 95.95,22.23 90.62,27.56 v90.31,27.56
  Bottom 0.305: v90.31,27.56 78.75,27.56 78.46,27.27 RL31.12
N$88  (via drill 0.3)
  Top 0.305: IC8.12 99.27,25.44 99.23,25.41 97.47,25.41 92.19,30.69 v89.69,30.69
  Bottom 0.305: v89.69,30.69 28.44,30.69 27.86,30.11 RL26.12
N$89  (via drill 0.3)
  Top 0.305: IC1.14 117.38,79.72 117.4,79.7 119.4,79.7 119.4,67.2 115.3,67.2 115.3,61.6 117.3,61.6 IC2.14 117.47,61.62 117.5,61.6 119.4,61.6 v119.4,51.8 119.4,48.8 115.3,48.8 115.3,43.2 IC3.14 | IC3.14 | IC3.14 119.4,43.2 119.4,30.2 115.3,30.2 115.3,24.8 117.3,24.8 117.31,24.8 IC4.14
  Bottom 0.305: CON1.3 123,52.7 122.1,51.8 v119.4,51.8
N$90
  Top 0.305: IC1.15 117.37,80.37 117.4,80.4 120.2,80.4 120.2,66.6 115.9,66.6 115.9,62.3 117.2,62.3 117.22,62.27 IC2.15 117.38,62.27 117.4,62.3 120.2,62.3 120.2,51.2 | 120.2,51.2 120.2,48.2 115.9,48.2 115.9,43.9 117.36,43.9 117.36,43.86 IC3.15 117.64,43.86 117.7,43.8 120.2,43.8 120.2,29.6 115.9,29.6 115.9,25.4 117.3,25.4 117.33,25.43 IC4.15 | CON1.2 123,50.24 123,50.3 122.1,51.2 120.2,51.2
N$91  (via drill 0.3)
  Top 0.305: IC8.13 99.25,24.79 99.23,24.77 97.17,24.77 91.88,30.06 v90.31,30.06
  Bottom 0.305: v90.31,30.06 38.44,30.06 37.98,29.61 RL27.12
N$92  (via drill 0.3)
  Top 0.305: IC8.14 96.86,24.14 91.56,29.44 v89.69,29.44
  Bottom 0.305: v89.69,29.44 48.75,29.44 48.1,28.79 RL28.12
N$93  (via drill 0.3)
  Top 0.305: IC8.15 99.25,23.49 99.23,23.5 96.56,23.5 91.25,28.81 v90.31,28.81
  Bottom 0.305: v90.31,28.81 58.75,28.81 58.22,28.28 RL29.12
N$94  (via drill 0.3)
  Top 0.305: IC8.16 99.27,22.84 99.23,22.87 96.26,22.87 90.94,28.19 v89.69,28.19
  Bottom 0.305: RL30.12 68.34,27.78 68.75,28.19 v89.69,28.19
N$95
  Top 0.305: R12.3 110.83,28.32 110.8,28.3 110.8,27 111.5,26.3 111.9,26.3 111.93,26.27 IC4.1
N$96
  Top 0.305: R11.3 109.87,28.33 109.9,28.3 109.9,26 110.5,25.4 111.9,25.4 111.93,25.43 IC4.2
N$97
  Top 0.305: R20.2 R10.3 108.92,28.32 108.9,28.3 108.9,25.8 109.9,24.8 111.9,24.8 111.91,24.8 IC4.3
N$98
  Top 0.305: IC3.1 111.93,44.67 111.9,44.7 111.5,44.7 110.8,45.4 110.8,46.7 110.83,46.73 R9.3
N$99
  Top 0.305: IC3.2 111.93,43.87 111.9,43.9 110.7,43.9 109.9,44.7 109.9,46.7 109.87,46.73 R8.3
N$100
  Top 0.305: R19.2 R7.3 108.92,46.72 108.9,46.7 108.9,44.3 110,43.2 111.9,43.2 111.91,43.21 IC3.3
N$101
  Top 0.305: IC2.1 111.9,63.1 111.5,63.1 110.8,63.8 110.8,65.1 R6.3
N$102
  Top 0.305: R5.3 109.9,65.1 109.9,62.9 110.5,62.3 111.9,62.3 IC2.2
N$103
  Top 0.305: R18.2 R4.3 108.9,65.1 108.9,62.5 109.8,61.6 111.9,61.6 IC2.3
N$104
  Top 0.305: 110.9,83.2 110.87,83.23 R3.3 110.9,83.16 110.9,81.8 111.6,81.1 111.9,81.1 111.93,81.13 IC1.1
N$105
  Top 0.305: R2.3 109.9,83.2 109.9,81 110.5,80.4 111.9,80.4 IC1.2
N$106
  Top 0.305: R17.2 R1.3 108.92,83.12 108.9,83.1 108.9,80.6 109.8,79.7 111.9,79.7 IC1.3
N$107
  Top 0.305: R13.3 113.3,81.7 113.3,79.8 113.9,79.2 116.1,79.2 116.23,79.07 IC1.13
N$108
  Top 0.305: IC2.13 117.3,61 116.6,61 116.5,61.1 114.2,61.1 113.1,62.2 113.1,63.8 R14.3
N$109
  Top 0.305: IC3.13 117.33,42.57 117.3,42.6 114,42.6 113.1,43.5 113.1,45.4 111.78,46.72 R15.3
N$110
  Top 0.305: R16.3 111.78,28.32 113.2,26.9 113.2,25.2 114.1,24.3 115.9,24.3 116,24.2 117.3,24.2 117.33,24.17 IC4.13
N$112  (via drill 0.3)
  Top 0.305: IC6.11 99.28,62.92 99.23,62.87 97.5,62.87 92.19,68.19 v90,68.19
  Bottom 0.305: v90,68.19 18.44,68.19 17.74,67.49 RL9.12
N$113  (via drill 0.3)
  Top 0.305: IC6.12 99.27,62.27 99.23,62.24 97.2,62.24 91.88,67.56 v89.38,67.56
  Bottom 0.305: v89.38,67.56 28.44,67.56 27.86,66.98 RL10.12
N$114  (via drill 0.3)
  Top 0.305: IC6.13 99.25,61.62 99.23,61.6 96.9,61.6 91.56,66.94 v90,66.94
  Bottom 0.305: v90,66.94 38.44,66.94 37.98,66.48 RL11.12
N$115  (via drill 0.3)
  Top 0.305: IC6.14 96.59,60.97 91.25,66.31 v89.38,66.31
  Bottom 0.305: v89.38,66.31 48.75,66.31 48.1,65.66 RL12.12
N$116  (via drill 0.3)
  Top 0.305: IC6.15 99.25,60.32 99.23,60.33 96.29,60.33 90.94,65.69 v90,65.69
  Bottom 0.305: v90,65.69 58.75,65.69 58.22,65.16 RL13.12
N$117  (via drill 0.3)
  Top 0.305: IC6.16 99.27,59.67 99.23,59.7 95.99,59.7 90.62,65.06 v89.38,65.06
  Bottom 0.305: v89.38,65.06 68.75,65.06 68.34,64.65 RL14.12
N$118  (via drill 0.3)
  Top 0.305: IC6.17 99.28,59.02 99.23,59.06 95.69,59.06 90.31,64.44 v90,64.44
  Bottom 0.305: RL15.12 78.46,63.84 79.06,64.44 v90,64.44
N$119
  Top 0.305: IC6.18 99.3,58.37 99.23,58.43 95.39,58.43 90.62,63.19 RL16.12
N$120  (via drill 0.3)
  Top 0.305: IC5.11 99.28,81.02 99.23,80.97 98.16,80.97 92.5,86.62 v90.31,86.62
  Bottom 0.305: v90.31,86.62 18.44,86.62 17.74,85.93 RL1.12
N$121  (via drill 0.3)
  Top 0.305: IC5.12 99.27,80.36 99.23,80.33 97.85,80.33 92.19,86 v89.69,86
  Bottom 0.305: v89.69,86 28.44,86 27.86,85.42 RL2.12
N$122  (via drill 0.3)
  Top 0.305: IC5.13 99.25,79.72 99.23,79.7 97.55,79.7 91.88,85.38 v90.31,85.38
  Bottom 0.305: v90.31,85.38 38.75,85.38 37.98,84.61 RL3.12
N$123  (via drill 0.3)
  Top 0.305: IC5.14 97.25,79.06 91.56,84.75 v89.69,84.75
  Bottom 0.305: v89.69,84.75 48.75,84.75 48.1,84.1 RL4.12
N$124  (via drill 0.3)
  Top 0.305: IC5.15 99.25,78.42 99.23,78.43 96.94,78.43 91.25,84.12 v90.31,84.12
  Bottom 0.305: v90.31,84.12 58.75,84.12 58.22,83.59 RL5.12
N$125  (via drill 0.3)
  Top 0.305: IC5.16 99.27,77.77 99.23,77.8 96.64,77.8 90.94,83.5 v89.69,83.5
  Bottom 0.305: v89.69,83.5 68.75,83.5 68.34,83.09 RL6.12
N$126  (via drill 0.3)
  Top 0.305: IC5.17 99.28,77.11 99.23,77.16 96.34,77.16 90.62,82.88 v90.31,82.88
  Bottom 0.305: v90.31,82.88 79.06,82.88 78.46,82.27 RL7.12
N$127
  Top 0.305: IC5.18 99.3,76.47 99.23,76.53 96.04,76.53 90.96,81.61 RL8.12
RELAY_POWER  (via drill 0.3)
  Top 0.305: IC6.10 99.35,63.62 99.55,63.83 | IC8.10 99.55,26.94 | IC7.10 99.55,45.35 | IC5.10 99.5,81.81
  Top 0.61: 99.55,63.83 C6.1 99.48,65.06 v98.75,65.06 | 99.55,45.35 C7.1 99.46,46.62 v98.75,46.62 | 99.55,26.94 C8.1 99.44,28.19 v98.75,28.19 | 99.5,81.81 C5.1 99.44,83.19 v98.75,83.19
  Top 0.813: X1.1 106.04,7.17 CON14.1
  other vias: 99,9.5 98,9.5 98.5,8.5 99,7.5 98,7.5 98.5,6.5 99,5.5 98,5.5 98.5,4.5 98.5,10.5
  pour Bottom: 11.56,82.88 93.69,82.88 93.69,76.62 11.56,76.62
  pour Bottom: 11.56,64.44 93.69,64.44 93.69,58.19 11.56,58.19
  pour Bottom: 11.56,46 93.69,46 93.69,39.75 11.56,39.75
  pour Bottom: 11.56,27.56 93.69,27.56 93.69,21.31 11.56,21.31
  pour Bottom: 99.38,84.12 99.38,4.12 93.69,4.12 93.69,84.12
  pour Top: 97.19,11 107.5,11 107.5,4.12 97.19,4.12
VCC  (via drill 0.3)
  Top 0.305: R20.1 108,29.56 108,31.3 109.9,31.3 | 109.9,31.3 109.9,29.56 R11.1 R11.2 | 110.8,31.3 110.8,29.56 R12.1 R12.2 | 111.8,31.3 111.8,29.56 R16.1 R16.2 | 109.9,31.3 110.8,31.3 | 110.8,31.3 111.8,31.3 | v118.3,31.3 111.8,31.3 | R19.1 108,47.95 108,49.8 109.9,49.8 | 109.9,49.8 111.8,49.8 | 109.9,49.8 109.9,47.95 R8.1 R8.2 | 111.8,49.8 111.8,47.95 R15.1 R15.2 | v118.2,49.8 111.8,49.8 | R18.1 108,66.33 108,68 110.8,68 | 110.8,68 110.8,66.33 R6.1 R6.2 | 111.8,66.33 R14.1 R14.2 | 111.8,66.33 111.8,66.3 | 111.8,66.33 111.8,68 | 111.8,68 110.8,68 | v118.3,68 111.8,68 | R17.1 108,84.43 108,86.1 111.8,86.1 | 111.8,84.43 R13.1 R13.2 | 111.8,84.43 111.8,84.4 | 111.8,84.43 111.8,86.1 | v118.3,86.1 111.8,86.1
  Top 0.61: v118.3,82.4 117.36,82.4 C1.1 117.33,82.43 IC1.16 | v118.3,64.3 C2.1 117.33,64.3 IC2.16 | v118.2,45.9 C3.1 117.33,45.89 IC3.16 | v118.3,27.5 117.36,27.5 C4.1 117.33,27.47 IC4.16
  Bottom 0.305: v118.3,86.1 118.3,82.9
  Bottom 0.813: CON1.1 120.21,47.69 120.2,47.7
  other vias: 120.1,14 118.5,14 118.5,12.6 119.3,13.3 120.1,12.6 119.3,11.9
  pour Bottom: 121,83 121,11 118,11 118,83
  pour Top: 108,15 121,15 121,11 108,11

### Text on the board
tPlace: MSB | LSB | 0100_000 | 0100_100 | 0100_001 | 0100_101 | GND | SCL | SDA | 0100_010 | 0100_110 | 0100_011 | 0100_111 | 5V/1.2A
_tNames: C5 | R17 | C1 | RL1 | RL2 | RL3 | RL4 | RL5 | RL6 | RL7 | RL8 | IC5 | IC1 | CON2 | C6 | R18 | RL9 | RL10 | RL11 | RL12 | RL13 | RL14 | RL15 | RL16 | IC6 | C2 | IC2 | CON3 | C7 | IC7 | R19 | C3 | RL17 | RL18 | RL19 | RL20 | RL21 | RL22 | RL23 | RL24 | IC3 | CON1 | CON4 | C8 | R20 | C4 | RL25 | RL26 | RL27 | RL28 | RL29 | RL30 | RL31 | RL32 | IC8 | IC4 | CON5 | C9 | X1 | CON6 | CON7 | CON8 | CON9 | CON10 | CON11 | CON12 | CON13 | CON14